# Altium schematic sheet Sheet1.SchDoc
size A
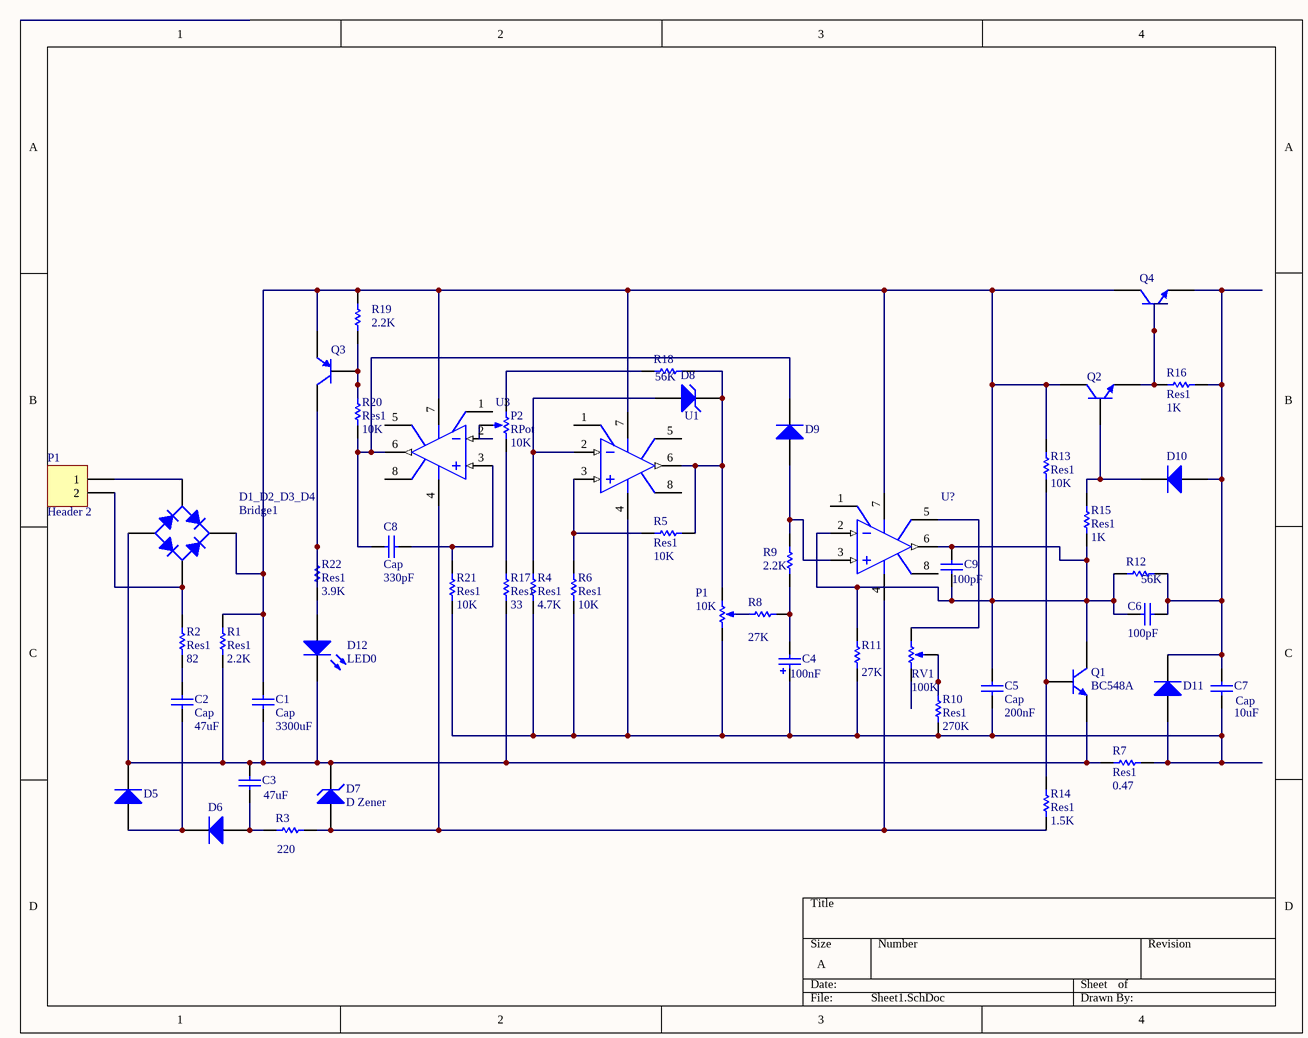
[diagram p0: Sheet1.SchDoc]

## Parts
(Parts that share a designator on the sheet are numbered #1, #2 ... from top to bottom, then left to right.)
C1  Cap  value 3300uF  [RAD-0.3]
C2  Cap  value 47uF  [RAD-0.3]
C3  value 47uF  [RAD-0.3]
C4  value 100nF  [POLAR0.8]
C5  Cap  value 200nF  [RAD-0.3]
C6  value 100pF  [RAD-0.3]
C7  Cap  value 10uF  [RAD-0.3]
C8  Cap  value 330pF  [RAD-0.3]
C9  value 100pF  [RAD-0.3]
D1_D2_D3_D4  Bridge1  [D-38]
D5  (no value)  [DO-35]
D6  (no value)  [DO-35]
D7  D Zener  [DIODE-0.7]
D8  (no value)  [DIODE-0.7]
D9  (no value)  [DO-35]
D10  (no value)  [DO-35]
D11  (no value)  [DO-41]
D12  LED0  [LED-0]
P1#1  Header 2  [HDR1X2]
P1#2  value 10K  [VR5]
P2  RPot  value 10K  [VR5]
Q1  BC548A  [29-04]
Q2  (no value)  [79-04]
Q3  (no value)  [TO-92A]
Q4  (no value)  [TO-92A]
R1  Res1  value 2.2K  [AXIAL-0.3]
R2  Res1  value 82  [AXIAL-0.3]
R3  value 220  [AXIAL-0.3]
R4  Res1  value 4.7K  [AXIAL-0.3]
R5  Res1  value 10K  [AXIAL-0.3]
R6  Res1  value 10K  [AXIAL-0.3]
R7  Res1  value 0.47  [AXIAL-0.3]
R8  value 27K  [AXIAL-0.3]
R9  value 2.2K  [AXIAL-0.3]
R10  Res1  value 270K  [AXIAL-0.3]
R11  value 27K  [AXIAL-0.3]
R12  value 56K  [AXIAL-0.3]
R13  Res1  value 10K  [AXIAL-0.3]
R14  Res1  value 1.5K  [AXIAL-0.3]
R15  Res1  value 1K  [AXIAL-0.3]
R16  Res1  value 1K  [AXIAL-0.3]
R17  Res1  value 33  [AXIAL-0.3]
R18  value 56K  [AXIAL-0.3]
R19  value 2.2K  [AXIAL-0.3]
R20  Res1  value 10K  [AXIAL-0.3]
R21  Res1  value 10K  [AXIAL-0.3]
R22  Res1  value 3.9K  [AXIAL-0.3]
RV1  value 100K  [VR5]
U1  (no value)  [751-02_N]
U3  (no value)  [751-02_N]
U?  (no value)  [751-02_N]

## Nets
NetC1_1: C1.1 C3.2 D1_D2_D3_D4.3(A) D5.2(K) D7.2(K) D12.2(K) Q1.3(E) R1.1 R7.1 R17.1
NetC1_2: C1.2 C5.2 C6.1 C9.1 C9.2 D1_D2_D3_D4.1(K) Q1.1(C) Q2.3(C) Q3.1(E) Q4.3(C) R1.2 R11.2 R12.1 R13.2 R15.1 R19.2 U1.7(V+) U3.7(V+) U?.2(IN-) U?.6(OUT) U?.7(V+)
NetC2_1: C2.1 D5.1(A) D6.2(K)
NetC2_2: C2.2 R2.1
NetC3_1: C3.1 D6.1(A) R3.1
NetC4_1: C4.1 C5.1 C7.1 D11.1(A) P1#2.1(TOP) R4.1 R6.1 R7.2 R10.1 R11.1 R21.1 U1.4(V-)
NetC4_2: C4.2 R8.2 R9.1
NetC6_2: C6.2 C7.2 D10.1(A) D11.2(K) Q4.1(E) R12.2 R16.2
NetC8_1: C8.1 D9.2(K) R20.1 U3.6(OUT)
NetC8_2: C8.2 R21.2 U3.3(IN+)
NetD1_D2_D3_D4_2: D1_D2_D3_D4.2(C) P1#1.2 R2.2
NetD1_D2_D3_D4_4: D1_D2_D3_D4.4(C) P1#1.1
NetD7_1: D7.1(A) R3.2 R14.1 U3.4(V-) U?.4(V-)
NetD8_1: D8.1(A) R4.2 U1.2(IN-)
NetD8_2: D8.2(K) P1#2.2(BOT) R5.2 R18.2 U1.6(OUT)
NetD9_1: D9.1(A) R9.2 U?.3(IN+)
NetD10_2: D10.2(K) Q2.2(B) R15.2
NetD12_1: D12.1(A) R22.1
NetP1#2_3: P1#2.3(TAP) R8.1
NetP2_1: P2.1(TOP) R18.1
NetP2_2: P2.2(BOT) R17.2
NetP2_3: P2.3(TAP) U3.2(IN-)
NetQ1_2: Q1.2(B) R13.1 R14.2
NetQ2_1: Q2.1(E) Q4.2(B) R16.1
NetQ3_2: Q3.2(B) R19.1 R20.2
NetQ3_3: Q3.3(C) R22.2
NetR5_1: R5.1 R6.2 U1.3(IN+)
NetR10_2: R10.2 RV1.3(TAP)
NetRV1_2: RV1.2(BOT) U?.5(OS_NULL)

Not connected (* = marked no-connect by the designer): RV1 1(TOP); U1 1(OS_NULL) 5(OS_NULL) 8(NC); U3 1(OS_NULL) 5(OS_NULL) 8(NC); U? 1(OS_NULL) 8(NC)

## Library data of the parts
C1-C3 C7 = Cap: Capacitor; Voltage: 50V; Published: 8-Jun-2000; LatestRevisionDate: 17-Jul-2002; LatestRevisionNote: Re-released for DXP Platform.; PackageReference: RAD-0.3; Publisher: Altium Limited; PackageDescription: Radial Cap, Thru-Hole; 2 Leads; 0.3 in Pin Spacing
C4 = Cap Pol2: Polarized Capacitor (Axial); Published: 8-Jun-2000; LatestRevisionDate: 17-Jul-2002; LatestRevisionNote: Re-released for DXP Platform.; PackageReference: POLAR0.8; Publisher: Altium Limited; PackageDescription: Polarized Capacitor; 2 Leads
C5 C6 C8 C9 = Cap: Capacitor; Published: 8-Jun-2000; LatestRevisionDate: 17-Jul-2002; LatestRevisionNote: Re-released for DXP Platform.; PackageReference: RAD-0.3; Publisher: Altium Limited; PackageDescription: Radial Cap, Thru-Hole; 2 Leads; 0.3 in Pin Spacing
D1_D2_D3_D4 = Bridge1: Full Wave Diode Bridge; Published: 8-Jun-2000; LatestRevisionDate: 29-May-2009; LatestRevisionNote: Sch pins A & K swapped.; DatasheetVersion: E2732B; PackageReference: D-38; Publisher: Altium Limited; PackageDescription: Bridge Rectifier; 4 Terminals; Body 9.4 x 9.4 mm (typ); Pitch 5.08 mm
D5 D6 D9 D10 = Diode 1N4148: High Conductance Fast Diode; Published: 8-Jun-2000; LatestRevisionDate: 17-Jul-2002; LatestRevisionNote: Re-released for DXP Platform.; DatasheetVersion: 1997; PackageReference: DO-35; Publisher: Altium Limited; PackageDescription: Diode, Axial; Body 3.8 x 1.9 mm (LxDia. max), Lead Dia. 0.53 mm (max); Code_JEDEC: DO-204-AH; ComponentLink1Description: Manufacturer Link; ComponentLink1URL: http://www.fairchildsemi.com/; ComponentLink2Description: Datasheet; ComponentLink2URL: http://www.fairchildsemi.com/ds/1N%2F1N4148.pdf
D7 D8 = D Zener: Zener Diode; Published: 8-Jun-2000; LatestRevisionDate: 17-Jul-2002; LatestRevisionNote: Re-released for DXP Platform.; PackageReference: DIODE-0.7; Publisher: Altium Limited; PackageDescription: Diode, Thru-Hole; 2 Leads; 0.7 in Pin Spacing
D11 = Diode 1N4001: 1 Amp General Purpose Rectifier; Published: 8-Jun-2000; LatestRevisionDate: 17-Jul-2002; LatestRevisionNote: Re-released for DXP Platform.; DatasheetVersion: 1998; PackageVersion: Aug-1999; PackageReference: DO-41; Publisher: Altium Limited; PackageDescription: Diode, Axial; Body 5.2 x 2.7 mm (LxDia. max), Lead Dia. 0.86 mm (max); Code_JEDEC: DO-204-AL; ComponentLink1Description: Manufacturer Link; ComponentLink1URL: http://www.fairchildsemi.com/; ComponentLink2Description: Datasheet; ComponentLink2URL: http://www.fairchildsemi.com/ds/1N%2F1N4001.pdf
D12 = LED0: Typical INFRARED GaAs LED; Published: 8-Jun-2000; LatestRevisionDate: 08-Jul-2005; LatestRevisionNote: Mech Layer 1 removed.; PackageReference: LED-0; Publisher: Altium Limited; PackageDescription: LED; 2 Leads
P1#1 = Header 2: Header, 2-Pin; LatestRevisionDate: 17-Jul-2002; LatestRevisionNote: Re-released for DXP Platform.; Publisher: Altium Limited
P1#2 P2 RV1 = RPot: Potentiometer; Sim Note: Enter the Resistance value and the set point into parameter fields.; Set Position: 0.5; Published: 8-Jun-2000; LatestRevisionDate: 17-Jul-2002; LatestRevisionNote: Re-released for DXP Platform.; PackageReference: VR5; Publisher: Altium Limited; PackageDescription: Variable Resistor, Thru-Hole; 3 Leads
Q1 = BC548A: Amplifier Transistor NPN Silicon; Published: 29-Sep-2000; LatestRevisionDate: 17-Jul-2002; LatestRevisionNote: Re-released for DXP Platform.; DatasheetVersion: 1991; PackageVersion: 1996; PackageReference: 29-04; Publisher: Altium Limited; PackageDescription: TO, Flat Index; 3 In-Line, Axial Leads; Body Dia. 4.8mm; Leads 0.48 x 0.5 mm (max); ComponentLink1Description: Manufacturer Link; ComponentLink1URL: http://www.onsemi.com/site/products/landing?taxonomyID=194; ComponentLink2Description: Datasheet; ComponentLink2URL: http://www.onsemi.com/pub/Collateral/BC546-D.PDF
Q2 = 2N2219: General Purpose Transistor NPN Silicon; Published: 29-Sep-2000; LatestRevisionDate: 17-Jul-2002; LatestRevisionNote: Re-released for DXP Platform.; DatasheetVersion: 1991; PackageVersion: 1997; PackageReference: 79-04; Publisher: Altium Limited; PackageDescription: Can; 3 Leads; Pin Circle Dia. 5.08 mm; Lead Dia. 0.48 mm (max); ComponentLink1Description: Manufacturer Link; ComponentLink1URL: http://www.onsemi.com/site/products/landing?taxonomyID=194
Q3 = 2N3906: PNP General Purpose Amplifier; Published: 8-Jun-2000; LatestRevisionDate: 15-Jan-2003; LatestRevisionNote: PCB Footprint 'BCY-W3/D4.7' replaced; DatasheetVersion: 1997; PackageVersion: Sep-1998; PackageReference: TO-92A; Publisher: Altium Limited; PackageDescription: TO, Flat Index; 3 In-Line, Axial Leads; Body Dia. 4.5mm; Leads 0.51 x 0.48 mm (max); ComponentLink1Description: Manufacturer Link; ComponentLink1URL: http://www.fairchildsemi.com/; ComponentLink2Description: Datasheet; ComponentLink2URL: http://www.fairchildsemi.com/ds/2N%2F2N3906.pdf
Q4 = 2N3904: NPN General Purpose Amplifier; Published: 8-Jun-2000; LatestRevisionDate: 15-Jan-2003; LatestRevisionNote: PCB Footprint 'BCY-W3/D4.7' replaced; DatasheetVersion: 1997; PackageVersion: Sep-1998; PackageReference: TO-92A; Publisher: Altium Limited; PackageDescription: TO, Flat Index; 3 In-Line, Axial Leads; Body Dia. 4.5mm; Leads 0.51 x 0.48 mm (max); ComponentLink1Description: Manufacturer Link; ComponentLink1URL: http://www.fairchildsemi.com/; ComponentLink2Description: Datasheet; ComponentLink2URL: http://www.fairchildsemi.com/ds/2N%2F2N3904.pdf
R1 = Res1: Resistor; Watt: 1W; Published: 8-Jun-2000; LatestRevisionDate: 17-Jul-2002; LatestRevisionNote: Re-released for DXP Platform.; PackageReference: AXIAL-0.3; Publisher: Altium Limited; PackageDescription: Axial Device, Thru-Hole; 2 Leads; 0.3 in Pin Spacing
R2 = Res1: Resistor; watt: 1.4W; Published: 8-Jun-2000; LatestRevisionDate: 17-Jul-2002; LatestRevisionNote: Re-released for DXP Platform.; PackageReference: AXIAL-0.3; Publisher: Altium Limited; PackageDescription: Axial Device, Thru-Hole; 2 Leads; 0.3 in Pin Spacing
R3-R5 R8-R22 = Res1: Resistor; Watt: 1.4W; Published: 8-Jun-2000; LatestRevisionDate: 17-Jul-2002; LatestRevisionNote: Re-released for DXP Platform.; PackageReference: AXIAL-0.3; Publisher: Altium Limited; PackageDescription: Axial Device, Thru-Hole; 2 Leads; 0.3 in Pin Spacing
R6 = Res1: Resistor; Parameter 1: 1.4W; Published: 8-Jun-2000; LatestRevisionDate: 17-Jul-2002; LatestRevisionNote: Re-released for DXP Platform.; PackageReference: AXIAL-0.3; Publisher: Altium Limited; PackageDescription: Axial Device, Thru-Hole; 2 Leads; 0.3 in Pin Spacing
R7 = Res1: Resistor; Watt: 5W; Published: 8-Jun-2000; LatestRevisionDate: 17-Jul-2002; LatestRevisionNote: Re-released for DXP Platform.; PackageReference: AXIAL-0.3; Publisher: Altium Limited; PackageDescription: Axial Device, Thru-Hole; 2 Leads; 0.3 in Pin Spacing
U1 U3 U? = TL081ACD: JFET-Input Operational Amplifier; Published: 17-Jul-2002; LatestRevisionDate: 13-Apr-2006; LatestRevisionNote: IPC-7351 Footprint Added.; DatasheetVersion: 1988; PackageReference: 751-02; Publisher: Altium Limited; PackageDescription: 8-Pin Small Outline Integrated Circuit 1.27 mm Pitch; Code_JEDEC: MS-012-AA; Code_IPC: SOIC127P600-8; ComponentLink1Description: Manufacturer Link; ComponentLink1URL: http://www.onsemi.com/site/products/parametrics/0,4446,251,00.html